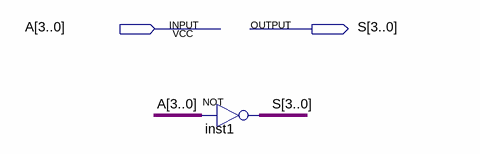
[diagram p0: schematic sheet]
// Quartus schematic OP_NOT.bdf as structural Verilog: 1 symbols, 2 pins
module OP_NOT (
  input  [3:0] A,
  output [3:0] S
);

  assign S = ~A;  // NOT inst1, 4 bits wide
endmodule
